# Altium schematic sheet Mag_Encoder_KMZ60.SchDoc: KMZ60_Mount
size A; DrawnBy: Simon Z; ProjectName: KMZ60
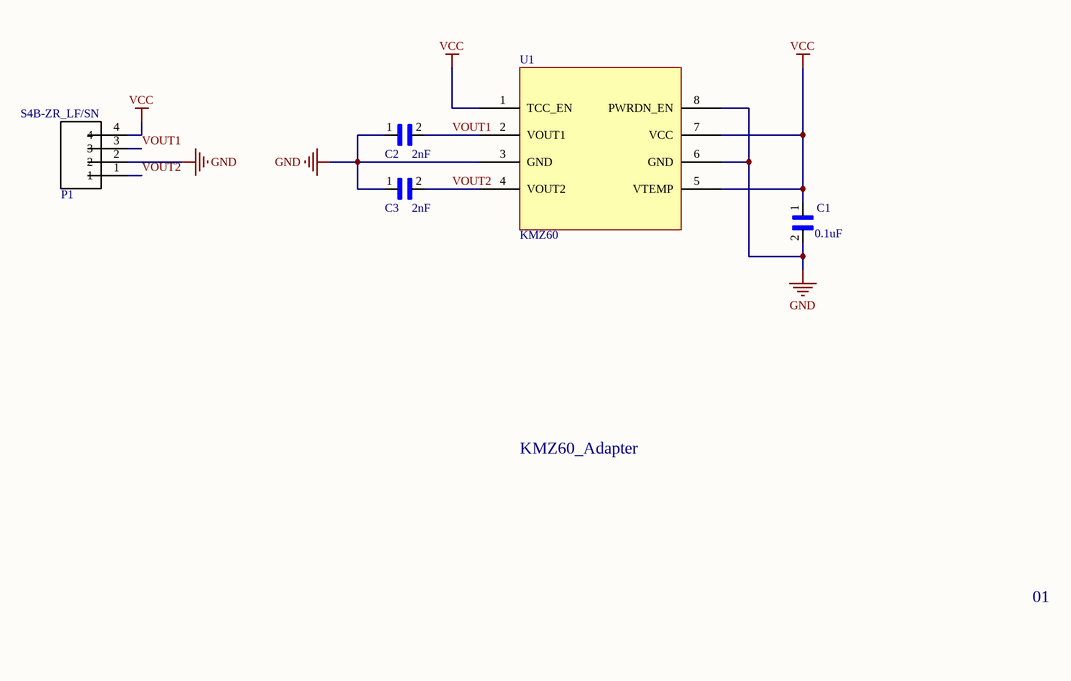
[diagram p0: Mag_Encoder_KMZ60.SchDoc]

## Parts
C1  value 0.1uF  [*CAPC1608X90N]  (hidden comment: CL10B104KB8NNNL)
C2  value 2nF  [*CAPC1608X90N]  (hidden comment: CL10B202KB8NNNC)
C3  value 2nF  [*CAPC1608X90N]  (hidden comment: CL10B202KB8NNNC)
P1  S4B-ZR_LF/SN  [*JST_S4B-ZR(LF)(SN)]
U1  KMZ60  [SOIC127P600X175-8N]

## Nets
GND: C1.2 C2.1 C3.1 P1.2 U1.3(GND) U1.6(GND) U1.8(PWRDN_EN)
VCC: C1.1 P1.4 U1.1(TCC_EN) U1.5(VTEMP) U1.7(VCC)
VOUT1: C2.2 P1.3 U1.2(VOUT1)
VOUT2: C3.2 P1.1 U1.4(VOUT2)

## Notes on the sheet
- KMZ60_Adapter
- 01
- Text

## Library data of the parts
C1 = CL10B104KB8NNNL: Cap Ceramic 0.1uF 50V X7R 10% Pad SMD 0603 125Â°C T/R; MF: Samsung Electro-Mechanics; Package: 0603 Samsung; SnapEDA_Link: https://www.snapeda.com/parts/CL10B104KB8NNNL/Samsung%20Electro-Mechanics/view-part/?ref=snap; Availability: Unavailable; MP: CL10B104KB8NNNL; Price: None
C2 C3 = CL10B104KB8NNNL: Cap Ceramic 2nF 50V X7R 10% Pad SMD 0603 125Â°C T/R; MF: Samsung Electro-Mechanics; Package: 0603 Samsung; SnapEDA_Link: https://www.snapeda.com/parts/CL10B104KB8NNNL/Samsung%20Electro-Mechanics/view-part/?ref=snap; Availability: Unavailable; MP: CL10B104KB8NNNL; Price: None
P1 = S4B-ZR_(LF)(SN): Conn Shrouded Header HDR 4 POS 1.5mm Solder RA Thru-Hole Box; MP: S4B-ZR _LF__SN_; MF: JST Sales; Package: None; Price: None; Availability: Unavailable; SnapEDA_Link: https://www.snapeda.com/parts/S4B-ZR%20%28LF%29%28SN%29/JST%20Sales%20America%20Inc./view-part/?ref=snap; Value: *
U1 = KVM60: Manufacturer: NXP; Model: KMZ60